# Altium schematic sheet 3V3Regulator.SchDoc
size A4; SheetNumber: 5; SheetTotal: 5
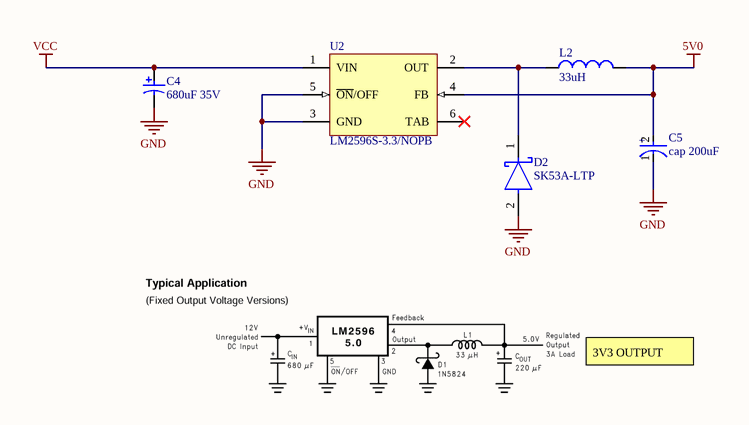
[diagram p0: 3V3Regulator.SchDoc]

## Parts
C4  680uF 35V  [NIC-CAPA2-10X10_V]
C5  cap 200uF  [CAPAE7262X77M]
D2  SK53A-LTP  [FP-DO-214AC-MFG]
L2  33uH  [INDM140130X52N]
U2  LM2596S-3.3/NOPB  [KTT0005B_M]

## Nets
5V0: C5.2(A) L2.2 U2.4(FB)
GND: C4.2 C5.1(C) D2.2(A) U2.3(GND) U2.5(~{ON}/OFF)
VCC: C4.1 U2.1(VIN)
NetD2_1: D2.1(C) L2.1 U2.2(OUT)

Not connected (* = marked no-connect by the designer): U2 6(TAB)*

## Notes on the sheet
- 3V3 OUTPUT
- (in symbol cap 200uF) +

## Library data of the parts
C4 = CMP-0687-00001-1: Aluminum Electrolytic Capacitor, UD Series, Low Impedance, 680 uF, 10 V, + / - 20%, -55 to 105 degC, Chip Type, 10 x 10 mm D x L, Pb-Free, Reel; PartNumber: UUD1A681MNL1GS; Manufacturer: Nichicon; Tolerance Rated Capacitance: -20 to 20%; Rated Voltage: 10 V; Impedance: 0.09 Ohm; Rated Ripple Current (at 100kHz): 670 mA; Packing: Dia382mm Reel; Endurance Time: 5000 h; RoHS: TRUE; PackageDescription: 2-Pin Surface Mount Device, Diameter 10 mm, Height 10 mm, Pitch 8 mm; DatasheetVersion: 08/2012; PackageReference: CAPAE-D10H10; ComponentLink1URL: http://www.nichicon.co.jp/; Rated Capacitance: 680 uF; Mounting Technology: Surface Mount; ComponentLink1Description: Manufacturer URL; Length: 10 mm; ComponentLink3Description: Package Specification; ComponentLink2URL: http://products.nichicon.co.jp/en/pdf/XJA043/e-ud.pdf; ComponentLink2Description: Datasheet; Diameter: 10 mm; ComponentLink3URL: http://products.nichicon.co.jp/en/pdf/XJA043/e-ud.pdf
D2 = CMP-56206-000004-1: DIODE SCHOTTKY 5A 30V SMA; Mount: Surface Mount; Max Reverse Voltage (DC): 30V; Case/Package: SMA; Packaging: Tape and Reel; Average Rectified Current: 5A
L2 = ind 330uH: Supplier 1: LCSC; Supplier Part Number 1: C19268660
U2 = CMP-0069-00275-3: SIMPLE SWITCHER® Power Converter 150 KHz 3A Step-Down Voltage Regulator, 5-pin TO-263, Pb-Free; Manufacturer: Texas Instruments; PackageTopMarking: NSUZXYTTE#*LM2596S*-3.3 P+; PowerWise: N; RoHS: Y; PackageReference: KTT0005B; PackageDescription: TO-263, Molded, .400 x .390 x .180in, 5 Lead, .067in Pitch, Surface Mount; PinCount: 5; ComponentLink1Description: Datasheet URL; Code_JEDEC: MO-169-AB; ComponentLink1URL: http://www.ti.com/general/docs/lit/getliterature.tsp?genericPartNumber=LM2596&fileType=pdf; CompType: Switcher
C5 = cap 200uF: Supplier 1: LCSC; Supplier Part Number 1: C4747975